# EAGLE schematic gesamt (EAGLE 9.6.2)
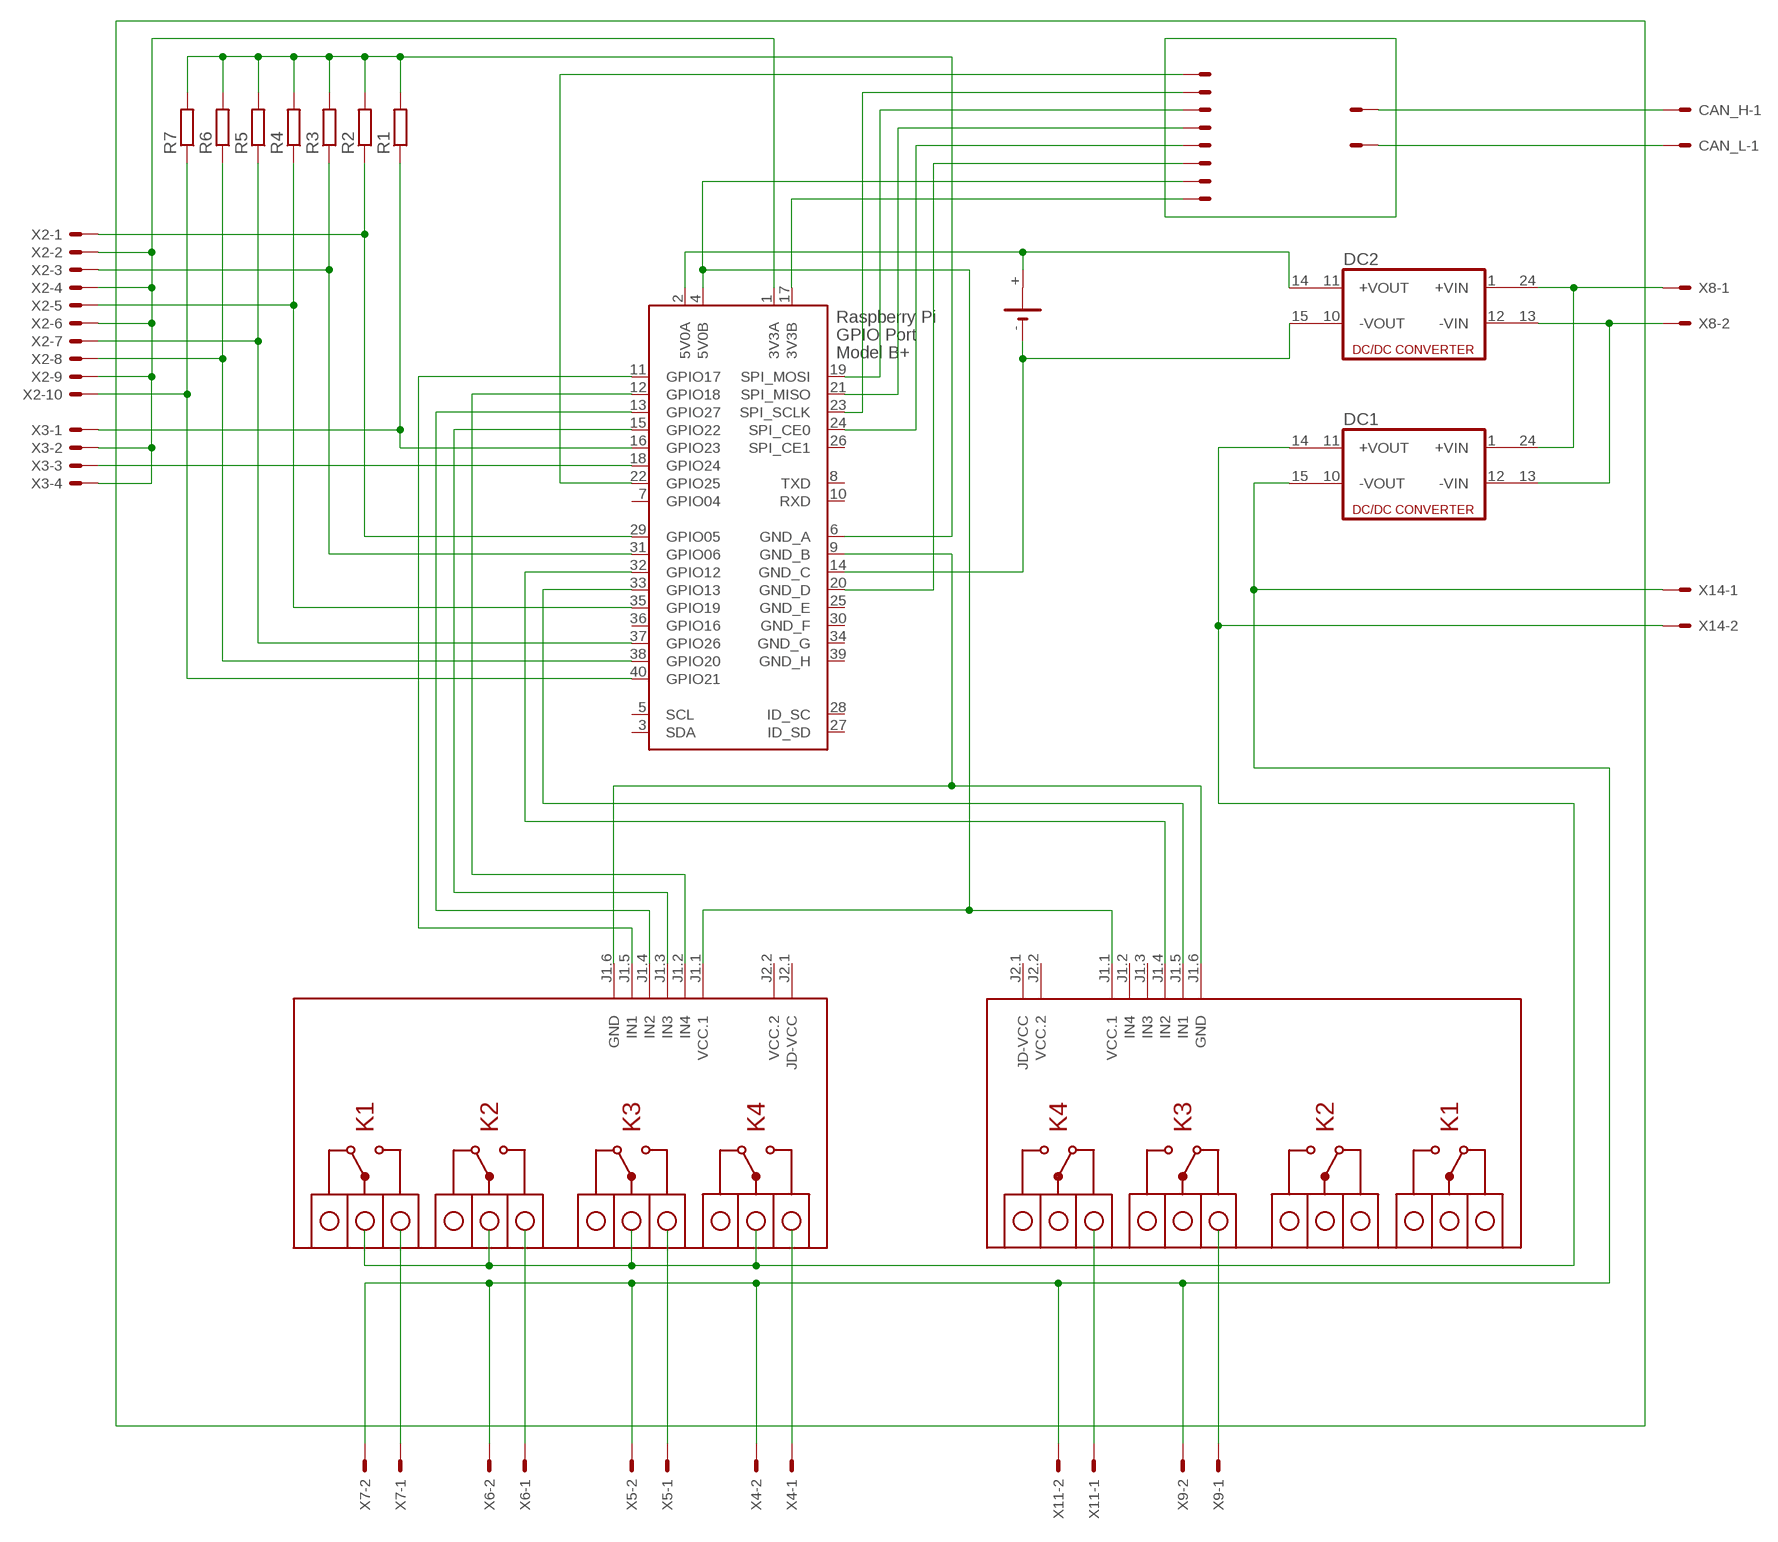
[diagram p0: schematic, sheet 1]

## Parts
CAN_H  5566-2  [5566-2]
CAN_L  5566-2  [5566-2]
DC1  DC213R  [CMK]
DC2  DC213R  [CMK]
G1  1V60R  [1V60R]
NAM  5566-8  [5566-8]
R1  R-EU_0204/7  [0204/7]
R2  R-EU_0204/7  [0204/7]
R3  R-EU_0204/7  [0204/7]
R4  R-EU_0204/7  [0204/7]
R5  R-EU_0204/7  [0204/7]
R6  R-EU_0204/7  [0204/7]
R7  R-EU_0204/7  [0204/7]
U$1  RELAY-4-SRD  [RELAY-4-SRD]
U$2  RELAY-4-SRD  [RELAY-4-SRD]
X1  RASPI_BOARD_B+#_FP  [RASPI_BOARD_B+_FULL_PAD]
X2  5566-10  [5566-10]
X3  5566-4  [5566-4]
X4  5566-2  [5566-2]
X5  5566-2  [5566-2]
X6  5566-2  [5566-2]
X7  5566-2  [5566-2]
X8  5566-2  [5566-2]
X9  5566-2  [5566-2]
X11  5566-2  [5566-2]
X13  5566-2  [5566-2]
X14  5566-2  [5566-2]

## Nets
N$1: R1.2 R2.2 R3.2 R4.2 R5.2 R6.2 R7.2 X1.6(GND_A)
N$2: R1.1 X1.16(GPIO23) X3.1
N$3: R2.1 X1.29(GPIO05) X2.1
N$4: R3.1 X1.31(GPIO06) X2.3
N$5: R4.1 X1.35(GPIO19) X2.5
N$6: R5.1 X1.37(GPIO26) X2.7
N$7: R6.1 X1.38(GPIO20) X2.8
N$8: R7.1 X1.40(GPIO21) X2.10
N$9: X1.1(3V3A) X2.2 X2.4 X2.6 X2.9 X3.2 X3.4
N$10: X1.18(GPIO24) X3.3
N$11: NAM.7 U$1.J1.1(VCC.1) U$2.J1.1(VCC.1) X1.4(5V0B)
N$12: DC1.24(+VIN1) DC2.24(+VIN1) X8.1
N$13: DC1.15(-VOUT1) X4.2 X5.2 X6.2 X7.2 X9.2 X11.2 X14.1
N$14: X7.1
N$15: DC1.14(+VOUT1) X14.2
N$16: X6.1
N$17: X9.1
N$18: X5.1
N$20: X4.1
N$21: DC2.14(+VOUT1) G1.+ X1.2(5V0A)
N$22: DC2.15(-VOUT1) G1.- X1.14(GND_C)
N$24: DC1.13(-VIN1) DC2.13(-VIN1) X8.2
N$26: U$1.J1.5(IN1) X1.11(GPIO17)
N$27: U$1.J1.4(IN2) X1.13(GPIO27)
N$28: U$1.J1.3(IN3) X1.15(GPIO22)
N$29: U$1.J1.2(IN4) X1.12(GPIO18)
N$30: U$1.J1.6(GND) U$2.J1.6(GND) X1.9(GND_B)
N$33: NAM.1 X1.22(GPIO25)
N$34: NAM.2 X1.23(SPI_SCLK)
N$36: U$2.J1.4(IN2) X1.32(GPIO12)
N$37: U$2.J1.5(IN1) X1.33(GPIO13)
N$38: NAM.3 X1.19(SPI_MOSI)
N$39: NAM.4 X1.21(SPI_MISO)
N$40: NAM.5 X1.24(SPI_CE0)
N$41: NAM.6 X1.20(GND_D)
N$42: NAM.8 X1.17(3V3B)
N$43: X11.1
N$46: CAN_H.1 X13.1
N$47: CAN_L.1 X13.2
Unconnected: CAN_H.2 CAN_L.2 DC1.1(+VIN) DC1.10(-VOUT) DC1.11(+VOUT) DC1.12(-VIN) DC2.1(+VIN) DC2.10(-VOUT) DC2.11(+VOUT) DC2.12(-VIN) G1.+@1(+) U$1.J2.1(JD-VCC) U$2.J1.2(IN4) U$2.J1.3(IN3) U$2.J2.1(JD-VCC) X1.3(SDA) X1.5(SCL) X1.7(GPIO04) X1.8(TXD) X1.10(RXD) X1.26(SPI_CE1) X1.27(ID_SD) X1.28(ID_SC) X1.36(GPIO16)

## Power pins joined to a net without a drawn wire
GND_E: X1.25(GND_E)
GND_F: X1.30(GND_F)
GND_G: X1.34(GND_G)
GND_H: X1.39(GND_H)
VCC.2: U$1.J2.2(VCC.2) U$2.J2.2(VCC.2)

## Library data of the parts
CAN_H CAN_L X4-X9 X11 X13 X14 = con-molex:5566-2: Mini FIT connector 2 pol Source: http://www.molex.com; MF: MOLEX; OC_FARNELL: 1822072; OC_NEWARK: unknown
DC1 DC2 = dc-dc-converter:DC213R: DC-DC CONVERTER; OC_FARNELL: unknown; OC_NEWARK: unknown
G1 = battery:1V60R: NC ACCU Varta
NAM = con-molex:5566-8: Mini FIT connector 8 pol Source: http://www.molex.com; MF: MOLEX; OC_FARNELL: unknown; OC_NEWARK: unknown
R1-R7 = rcl:R-EU_: RESISTOR, European symbol; SPICEPREFIX: R
U$1 U$2 = diy-modules:RELAY-4-SRD: 4-Channel Relay Module based on SRD-05VDC-SL-C relays Click here to find device on ebay.com <http://www.ebay.com/sch/four+channel+relay+module+optocoupler+5v>
X1 = raspberrypi_bastelstube_v13:RASPI_BOARD_B+#: Raspberry Pi GPIO connector with markings for the outer dimensions of the Raspberry Pi board model B+ with different sets of drill holes or mounting pads All pins connected
X2 = con-molex:5566-10: Mini FIT connector 10 pol Source: http://www.molex.com; MF: MOLEX; OC_FARNELL: unknown; OC_NEWARK: unknown
X3 = con-molex:5566-4: Mini FIT connector 4 pol Source: http://www.molex.com; MF: MOLEX; OC_FARNELL: unknown; OC_NEWARK: unknown